# Altium schematic sheet bldc-robot-main-board-2016.SchDoc
size A3
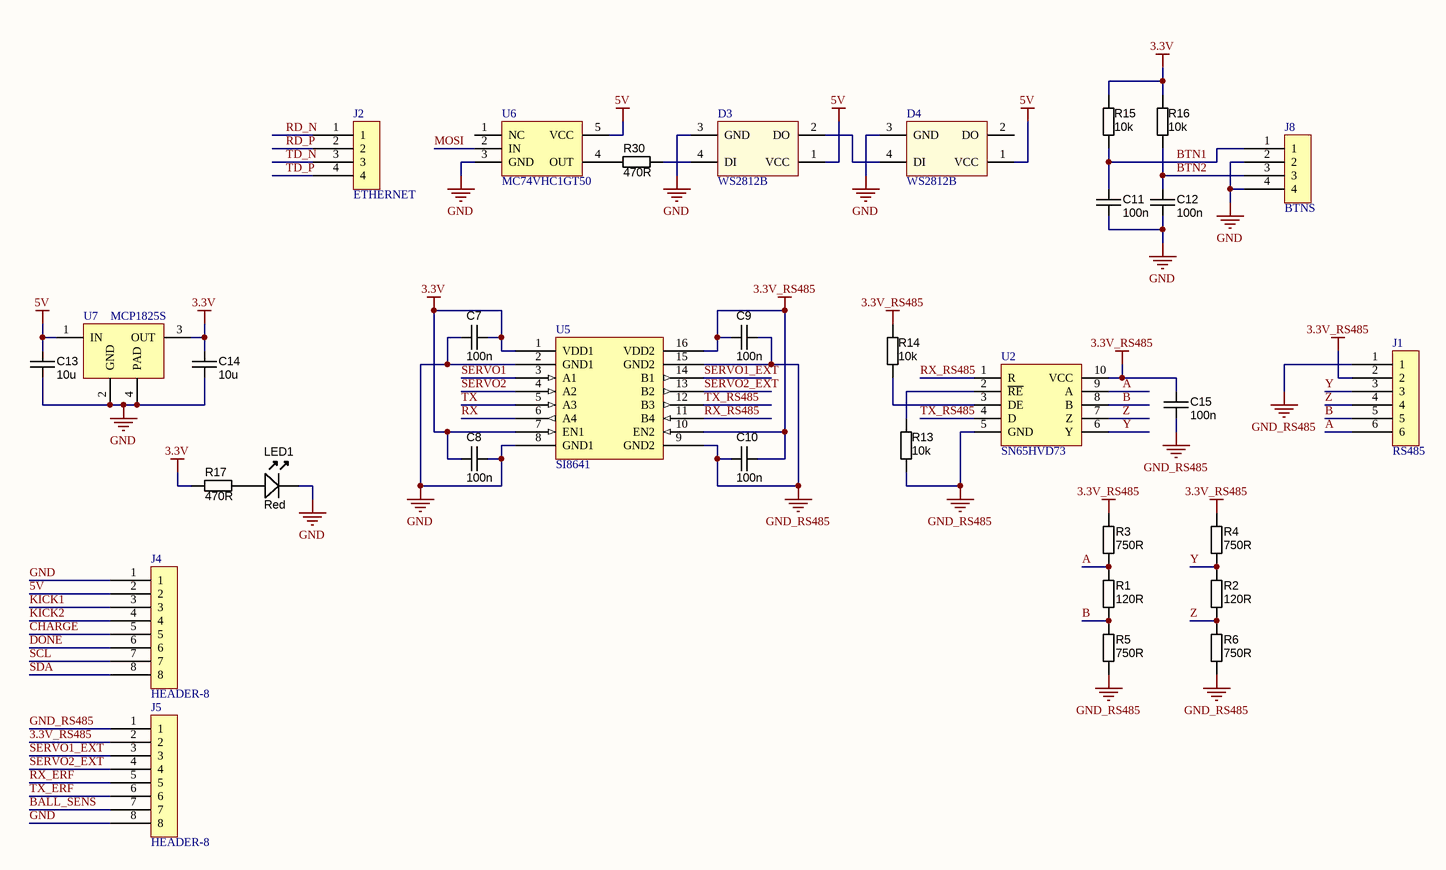
[diagram p0: bldc-robot-main-board-2016.SchDoc]

## Parts
C7  100n  [CAPC1608X90N]
C8  100n  [CAPC1608X90N]
C9  100n  [CAPC1608X90N]
C10  100n  [CAPC1608X90N]
C11  100n  [CAPC1608X90N]
C12  100n  [CAPC1608X90N]
C13  10u  [CAPC3216X180N]
C14  10u  [CAPC3216X180N]
C15  100n  [CAPC1608X90N]
D3  WS2812B  [WS2812B]
D4  WS2812B  [WS2812B]
J1  RS485  [MICRO-MATCH-6]
J2  ETHERNET  [MICRO-MATCH-4]
J4  HEADER-8  [MICRO-MATCH-8]
J5  HEADER-8  [MICRO-MATCH-8]
J8  BTNS  [MICRO-MATCH-4]
LED1  Red  [LED-0603-RED]
R1  120R  [RESC1608X55N]
R2  120R  [RESC1608X55N]
R3  750R  [RESC1608X55N]
R4  750R  [RESC1608X55N]
R5  750R  [RESC1608X55N]
R6  750R  [RESC1608X55N]
R13  10k  [RESC1608X55N]
R14  10k  [RESC1608X55N]
R15  10k  [RESC1608X55N]
R16  10k  [RESC1608X55N]
R17  470R  [RESC1608X55N]
R30  470R  [RESC1608X55N]
U2  SN65HVD73  [SOP10]
U5  SI8641  [SOIC16]
U6  MC74VHC1GT50  [SC70-5]
U7  MCP1825S  [SOT230P700X180-4N]

## Nets
3.3V: C7.1 C8.2 C14.1 R15.2 R16.2 R17.2 U5.1(VDD1) U5.7(EN1) U7.3(OUT)
3.3V_RS485: C9.2 C10.1 C15.1 J1.2 J5.2 R3.1 R4.1 R14.2 U2.10(VCC) U5.10(EN2) U5.16(VDD2)
5V: C13.1 D3.1(VCC) D4.1(VCC) J4.2 U6.5(VCC) U7.1(IN)
GND: C7.2 C8.1 C11.2 C12.2 C13.2 C14.2 D3.3(GND) D4.3(GND) J4.1 J5.8 J8.2 J8.4 LED1.K U5.2(GND1) U5.8(GND1) U6.3(GND) U7.2(GND) U7.4(PAD)
GND_RS485: C9.1 C10.2 C15.2 J1.1 J5.1 R5.2 R6.2 R13.1 U2.5(GND) U5.9(GND2) U5.15(GND2)
A: J1.6 R1.1 R3.2 U2.9(A)
B: J1.5 R1.2 R5.1 U2.8(B)
BALL_SENS: J5.7
BTN1: C11.1 J8.1 R15.1
BTN2: C12.1 J8.3 R16.1
CHARGE: J4.5
DONE: J4.6
KICK1: J4.3
KICK2: J4.4
MOSI: U6.2(IN)
RD_N: J2.1
RD_P: J2.2
RX: U5.6(A4)
RX_ERF: J5.5
RX_RS485: U2.1(R) U5.11(B4)
SCL: J4.7
SDA: J4.8
SERVO1: U5.3(A1)
SERVO1_EXT: J5.3 U5.14(B1)
SERVO2: U5.4(A2)
SERVO2_EXT: J5.4 U5.13(B2)
TD_N: J2.3
TD_P: J2.4
TX: U5.5(A3)
TX_ERF: J5.6
TX_RS485: U2.4(D) U5.12(B3)
Y: J1.3 R2.1 R4.2 U2.6(Y)
Z: J1.4 R2.2 R6.1 U2.7(Z)
NetD3_2: D3.2(DO) D4.4(DI)
NetD3_4: D3.4(DI) R30.1
NetLED1_A: LED1.A R17.1
NetR13_2: R13.2 U2.2(~{RE})
NetR14_1: R14.1 U2.3(DE)
NetR30_2: R30.2 U6.4(OUT)

Not connected (* = marked no-connect by the designer): D4 2(DO); U6 1(NC)

## Library data of the parts
C7-C12 C15 = CAPC_100n_0603_X7R_50V_10%: Capacitor SMD Cer 100nF 10% 50V X7R 0603; Manufacturer 1: AVX Corporation; Manufacturer Part Number 1: 06035C104KAT2A; Ratings: 50V; X7R; Material: ceramic; SCDType: spec; Manufacturer 2: TDK Corporation; Manufacturer Part Number 2: C1608X7R1H104K; Package / Case: 0603 (1608 Metric); Tolerance: ±10%; Supplier 1: Digi-Key; Supplier Part Number 1: 478-5052-1-ND; ComponentLink1URL: http://www.avx.com/docs/Catalogs/cx7r.pdf; ComponentLink1Description: http://www.avx.com/docs/Catalogs/cx7r.pdf; Supplier 2: Digi-Key; Supplier Part Number 2: 445-1314-1-ND; ComponentLink2URL: http://product.tdk.com/capacitor/mlcc/en/documents/mlcc_commercial_general_en.pdf; ComponentLink2Description: http://product.tdk.com/capacitor/mlcc/en/documents/mlcc_commercial_general_en.pdf; Value: 100n
C13 C14 = CAPC_10u_1206_10V: Capacitor SMD Cer 10uF 10% 10V X5R 1206; Manufacturer 1: KEMET; Manufacturer Part Number 1: C1206C106K8PACTU; Ratings: 10V; X5R; Material: ceramic; Value: 10µ; SCDType: undef; Package / Case: 1206 (3216 metric); Tolerance: ±10%; Supplier 1: Digi-Key; Supplier Part Number 1: C1206C106K8PACTU-ND
J1 = HEADER-6
J2 J8 = HEADER-4
LED1 = LED_SMD_Red_0603_220mcd: LED 0603 SMD Hyper Red 630nm 220mcd 20mA; Manufacturer 1: Kingbright Company LLC; Manufacturer Part Number 1: APT1608SURCK; Material: AlGaInP on GaAs; Ratings: 220 mcd; 630 nm; Voltage - Forward (Vf) Typ: 1.95V; Voltage - Forward (Vf) @ 10mA: 1.9V; SCDType: source; Package / Case: 0603 (1608 metric); Supplier 1: Digi-Key; Supplier Part Number 1: 754-1123-1-ND; ComponentLink1URL: http://www.us.kingbright.com/images/catalog/SPEC/APT1608SURCK.pdf; ComponentLink1Description: http://www.us.kingbright.com/images/catalog/SPEC/APT1608SURCK.pdf
R1 R2 = RES_120R_0603_5%: Resistor SMD chip 120 Ohm 0.1W 5% 0603; Manufacturer 1: Vishay Dale; Manufacturer Part Number 1: CRCW0603120RJNEA; Ratings: 1/10 W; SCDType: spec; Package / Case: 0603 (1608 metric); Tolerance: ±5%; Material: Thick Film; Supplier 1: Digi-Key; Supplier Part Number 1: 541-120GCT-ND; ComponentLink1URL: http://www.vishay.com/doc?20035; ComponentLink1Description: http://www.vishay.com/doc?20035; Supplier 2: Digi-Key; Supplier Part Number 2: 311-120GRCT-ND; Manufacturer 2: Yageo; Manufacturer Part Number 2: RC0603JR-07120RL; ComponentLink2URL: http://www.yageo.com/documents/recent/PYu-RC0603_51_RoHS_L_4.pdf; ComponentLink2Description: http://www.yageo.com/documents/recent/PYu-RC0603_51_RoHS_L_4.pdf; Value: 120R
R3-R6 R13-R17 R30 = RES_120R_0603_5%: Resistor SMD chip 120 Ohm 0.1W 5% 0603; Manufacturer 1: Vishay Dale; Manufacturer Part Number 1: CRCW0603120RJNEA; Ratings: 1/10 W; SCDType: spec; Value: 120R; Package / Case: 0603 (1608 metric); Tolerance: ±5%; Material: Thick Film; Supplier 1: Digi-Key; Supplier Part Number 1: 541-120GCT-ND; ComponentLink1URL: http://www.vishay.com/doc?20035; ComponentLink1Description: http://www.vishay.com/doc?20035; Supplier 2: Digi-Key; Supplier Part Number 2: 311-120GRCT-ND; Manufacturer 2: Yageo; Manufacturer Part Number 2: RC0603JR-07120RL; ComponentLink2URL: http://www.yageo.com/documents/recent/PYu-RC0603_51_RoHS_L_4.pdf; ComponentLink2Description: http://www.yageo.com/documents/recent/PYu-RC0603_51_RoHS_L_4.pdf
U2 = SN65HVD3086E
U7 = MIC5239